# Altium project MSPM0G3507板卡.PrjPcb
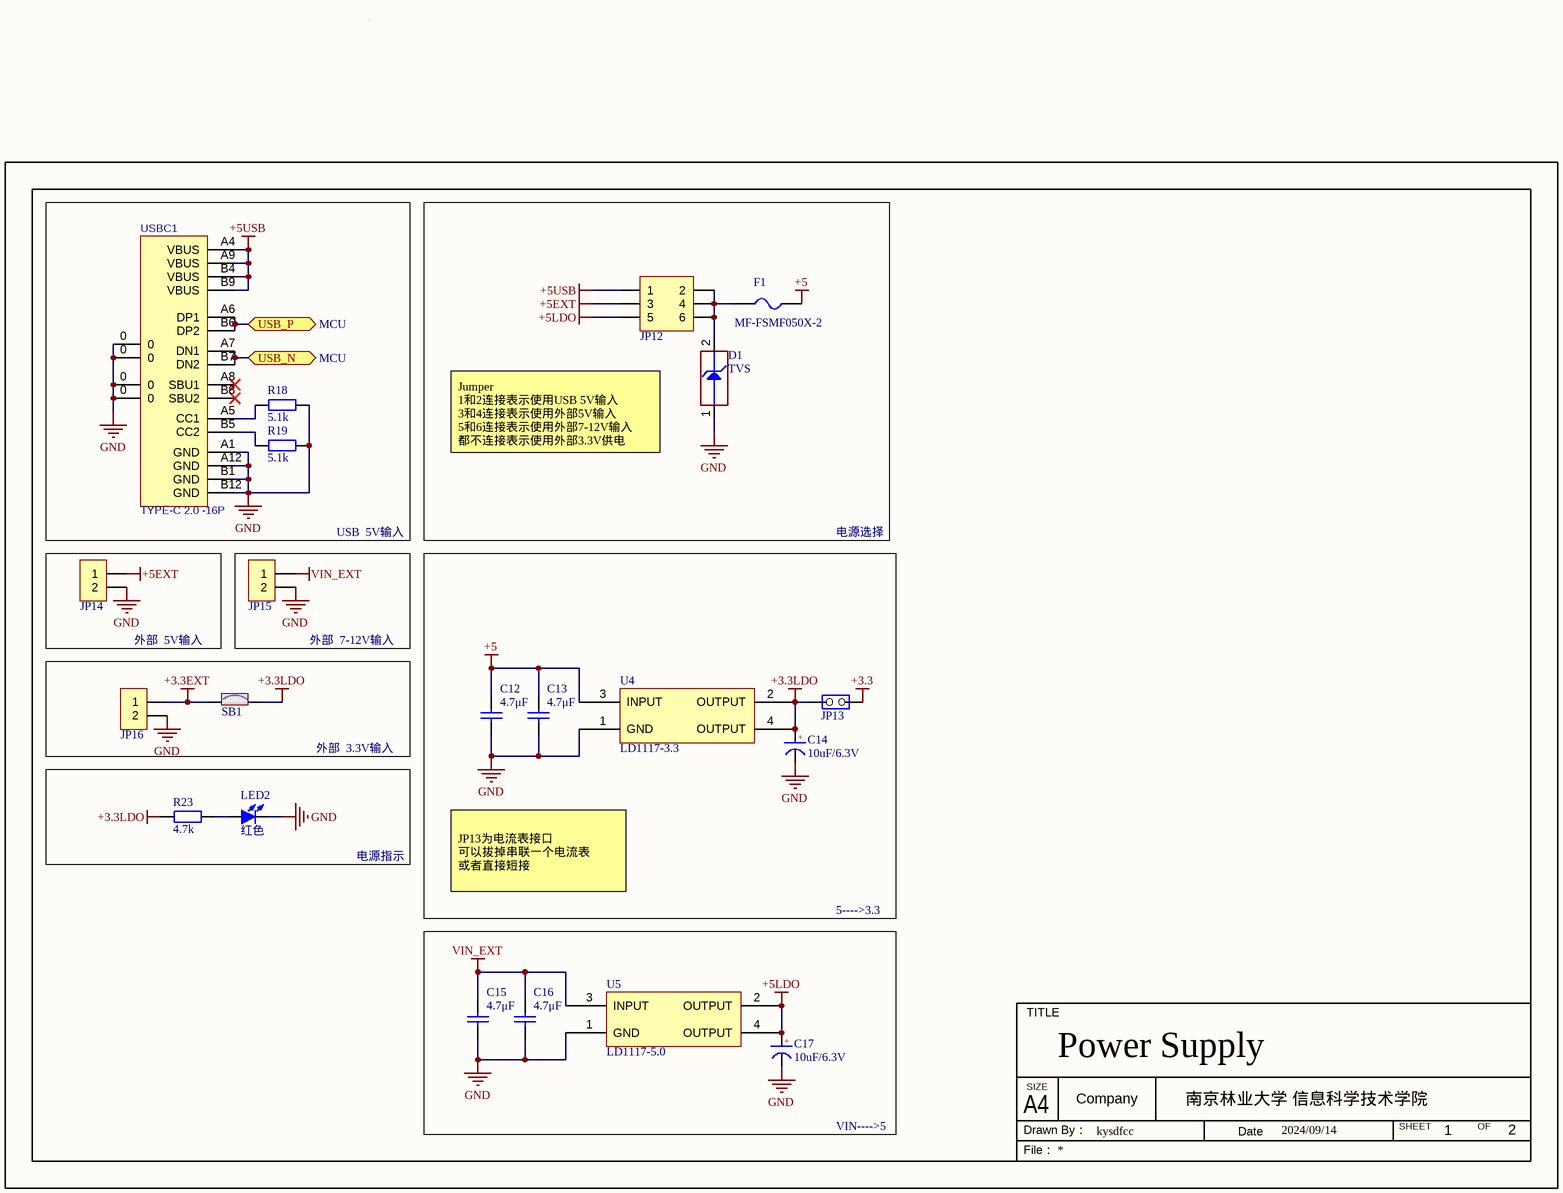
[diagram p0: Power_Supply.SchDoc]
2 sheets, 71 parts. Net scope: flat (ports and power ports of the same name join across sheets).
Board file: Board.PcbDoc
Sheets:
  Power_Supply.SchDoc
  MCU.SchDoc

## Sheet Power_Supply.SchDoc: Power Supply
size A4; Date: 2024/09/14; Author: kysdfcc; CompanyName: 南京林业大学 信息科学技术学院; SheetNumber: 1; SheetTotal: 2

### Parts
C12  4.7μF  [C 0603_L]
C13  4.7μF  [C 0603_L]
C14  10uF/6.3V  [CD A(3216)]
C15  4.7μF  [C 0603_L]
C16  4.7μF  [C 0603_L]
C17  10uF/6.3V  [CD A(3216)]
D1  TVS  [SOD-123]
F1  MF-FSMF050X-2  [FU 0603]
JP12  Header3X2  [HDR2.54-LI-2x3P]  (value not drawn)
JP13  Jumper_Header 2x1  [CON_SAMTEC_TSW-102-07-G-S]  (value not drawn)
JP14  HDR-1X2  [HDR2.54-LI-2P]  (value not drawn)
JP15  HDR-1X2  [HDR2.54-LI-2P]  (value not drawn)
JP16  HDR-1X2  [HDR2.54-LI-2P]  (value not drawn)
LED2  红色  [LED 0603R]
R18  5.1k  [R 0603_L]
R19  5.1k  [R 0603_L]
R23  4.7k  [R 0603_L]
SB1  SB_ON  [SOLDER-BRIDGE_R0603-0R]  (value not drawn)
U4  LD1117-3.3  [LM1117 SOT223]
U5  LD1117-5.0  [LM1117 SOT223]
USBC1  TYPE-C 2.0 -16P  [USB-C-SMD_TYPE-C-USB-5]

### Blocks framed on the sheet
USB  5V输入: R18 R19 USBC1
电源选择: D1 F1 JP12
外部  5V输入: JP14
5---->3.3: C12-C14 JP13 U4

### Ports
USB_N (bidir, see MCU), USB_P (bidir, see MCU)

### Nets
+3.3: JP13.2(NO)
+3.3EXT: JP16.1 SB1.1
+3.3LDO: C14.1(A) JP13.1(COMMON) R23.2 SB1.2 U4.2(OUTPUT) U4.4(OUTPUT)
+5: C12.2 C13.2 F1.2 U4.3(INPUT)
+5EXT: JP12.3 JP14.1
+5LDO: C17.1(A) JP12.5 U5.2(OUTPUT) U5.4(OUTPUT)
+5USB: JP12.1 USBC1.A4(VBUS) USBC1.A9(VBUS) USBC1.B4(VBUS) USBC1.B9(VBUS)
GND: C12.1 C13.1 C14.2(K) C15.1 C16.1 C17.2(K) D1.1(IO1) JP14.2 JP15.2 JP16.2 LED2.2(K) R18.2 R19.2 U4.1(GND) U5.1(GND) USBC1.0 USBC1.A1(GND) USBC1.A12(GND) USBC1.B1(GND) USBC1.B12(GND)
VIN_EXT: C15.2 C16.2 JP15.1 U5.3(INPUT)
NetD1_2: D1.2(GND) F1.1 JP12.2 JP12.4 JP12.6
NetLED2_1: LED2.1(A) R23.1
NetR18_1: R18.1 USBC1.A5(CC1)
NetR19_1: R19.1 USBC1.B5(CC2)
NetU2_1: USBC1.A6(DP1) USBC1.B6(DP2) ; port USB_P
NetU2_2: USBC1.A7(DN1) USBC1.B7(DN2) ; port USB_N

Not connected (* = marked no-connect by the designer): USBC1 A8(SBU1)* B8(SBU2)*

### Notes on the sheet
- Jumper
  1和2连接表示使用USB 5V输入
  3和4连接表示使用外部5V输入
  5和6连接表示使用外部7-12V输入
  都不连接表示使用外部3.3V供电
- 外部  7-12V输入
- 外部  3.3V输入
- 电源指示
- JP13为电流表接口
  可以拔掉串联一个电流表
  或者直接短接
- VIN---->5
- TITLE
- SIZE
- A4
- Drawn By：
- File：
- Company
- Date
- SHEET
- OF
- (in symbol CT) +

### Library data of the parts
C12 C13 C15 C16 = C: 贴片电容; Name: 无极性贴片电容
C14 C17 = CT: 贴片钽电容; Name: 贴片钽电容
D1 = TVS: High power Transient voltage suppressor:25V/35A EOS and ESD transients protection.; Internal_Part_Number: MCD-01207; Part_Type: Diode; Manufacturer_Part_Number: ESDA25P35-1U1M; Manufacturer: STMICROELECTRONICS; BMS_Part_Number: 9179045; ECCN_US: EAR99; ECCN_EU: NEC; Provided_By: SUBCO with ST control; Status: Checked; Package: QFN1610; ComponentLink1Description: Datasheet; ComponentLink1URL: http://tunmcdsvn.tun.st.com/Component_Datasheet_Library/Trunk/Diodes/STM_ESD_ESDA25P35-1U1M; Value: TVS
F1 = FU: 贴片保险丝; Name: 贴片保险丝
JP12 = Header 3X2: 3*2P接插件; Name: 3*2P接插件
JP13 = Header 2x1: Header, 2x1, 2,54mm, VR, TH, Height 5.84mm/2.54mm; Internal_Part_Number: MCD-00045; Part_Preference: Recommended; Part_Type: Connector; Manufacturer: SAMTEC; Manufacturer_Part_Number: TSW-102-07-G-S; Alternate_Manufacturer: JIUBABA; LIANYI; Alternate_Manufacturer_Part_Number: 313102S111116;313102S111116; Status: Released; ComponentLink1Description: Datasheet; ComponentLink1URL: http://tunmcdsvn.tun.st.com/Component_Datasheet_Library/Trunk/Connectors/Samtec_TSW-HTSW-series
JP14-JP16 = Header 2: 2P接插件; Name: 2P接插件
LED2 = LED-SMD: 贴片LED; Name: 贴片LED
R18 R19 R23 = R: 贴片电阻; Name: 贴片电阻
SB1 = Solder Bridge: Solder Bridge ON; Internal_Part_Number: MCD-00071; Part_Type: Mechanical; Manufacturer_Part_Number: RC0603JR-070RL; Manufacturer: YAGEO; Provided_By: SUBCO; Status: Released; ComponentLink1Description: Datasheet; Package: SB0603; ComponentLink1URL: http://tunmcdsvn.tun.st.com/Component_Datasheet_Library/Trunk/Resistors/Yageo_Resistor_RC0603-series; ECCN_US: n/a; ECCN_EU: n/a
U4 U5 = LD1117
USBC1 = USB2.0 Type-C 16Pin母座: USB2.0 Type-C 母座 16Pin

## Sheet MCU.SchDoc: MCU I/O 外设
size 420 x 297 mm; Date: 2024/09/14; Author: kysdfcc; CompanyName: 南京林业大学 信息科学技术学院; SheetNumber: 2; SheetTotal: 2
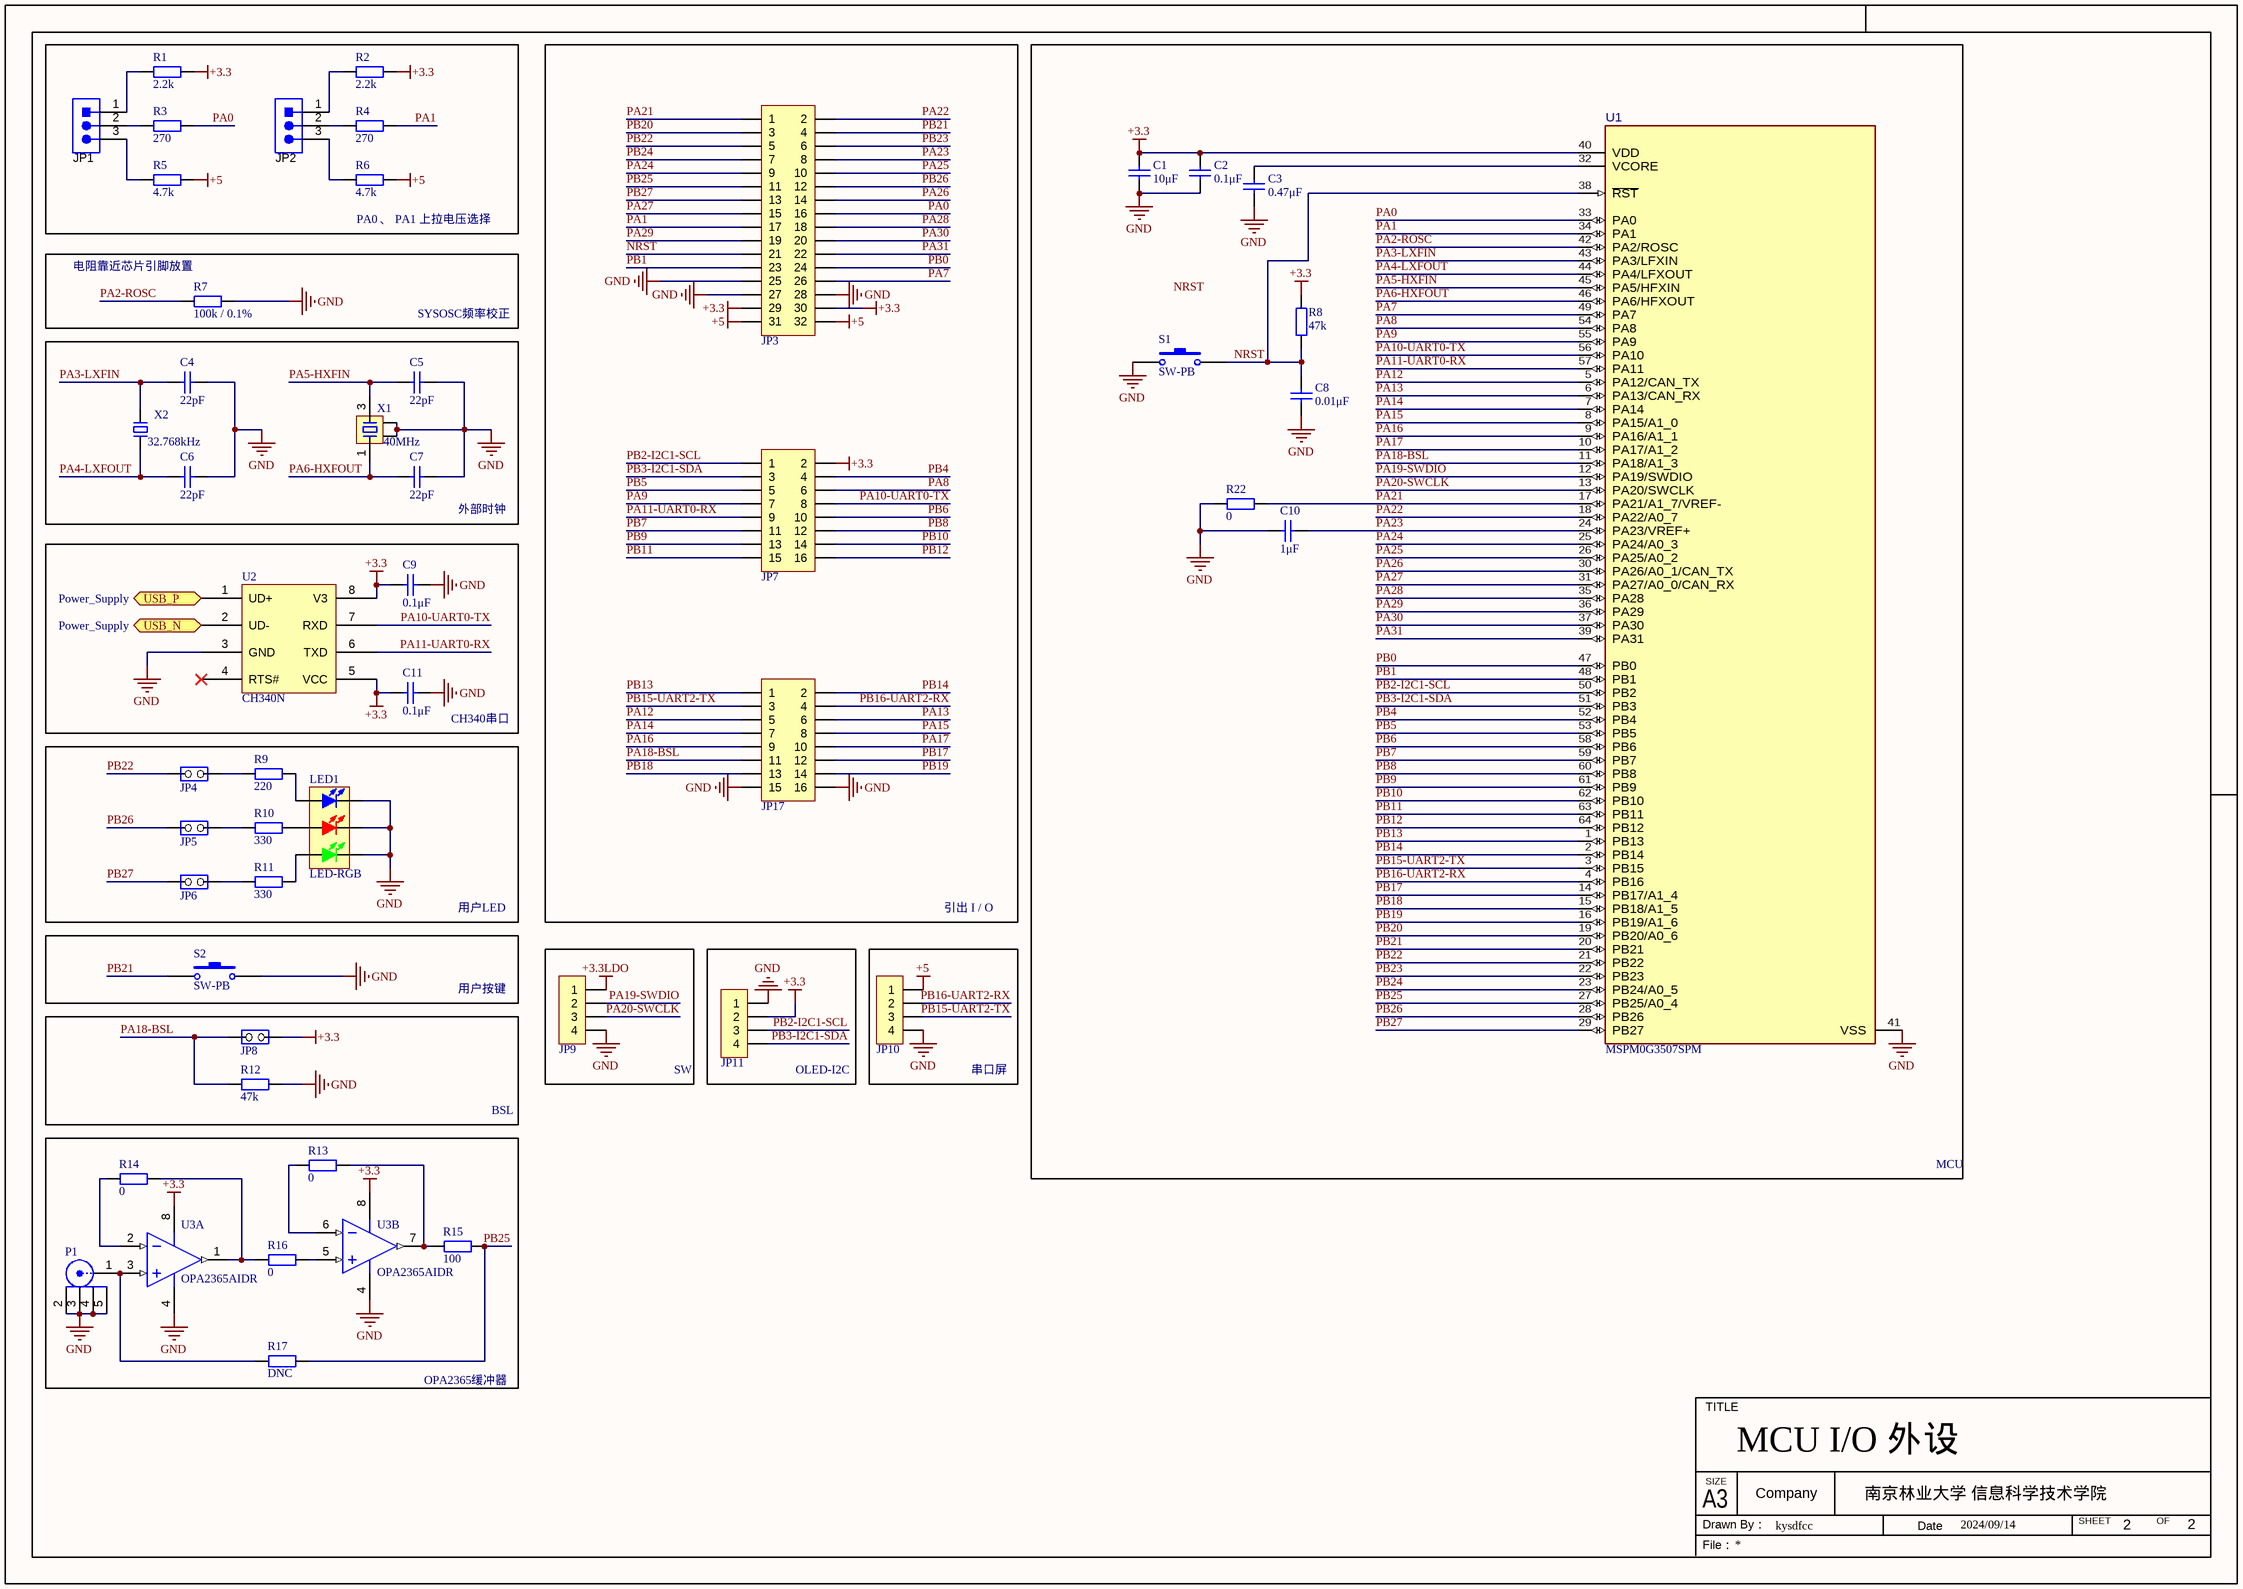
[diagram p1: MCU.SchDoc]

### Parts
C1  10μF  [C 0603_L]
C2  0.1μF  [C 0603_L]
C3  0.47μF  [C 0603_L]
C4  22pF  [C 0603_L]
C5  22pF  [C 0603_L]
C6  22pF  [C 0603_L]
C7  22pF  [C 0603_L]
C8  0.01μF  [C 0603_L]
C9  0.1μF  [C 0603_L]
C10  1μF  [C 0603_L]
C11  0.1μF  [C 0603_L]
JP1  PEC03SAAN  [CONN_PEC03SAAN]  (value not drawn)
JP2  PEC03SAAN  [CONN_PEC03SAAN]  (value not drawn)
JP3  Header 2X11  [HDR2.54-LI-2x16P]  (value not drawn)
JP4  Jumper_Header 2x1  [CON_SAMTEC_TSW-102-07-G-S]  (value not drawn)
JP5  Jumper_Header 2x1  [CON_SAMTEC_TSW-102-07-G-S]  (value not drawn)
JP6  Jumper_Header 2x1  [CON_SAMTEC_TSW-102-07-G-S]  (value not drawn)
JP7  Header 8X2  [HDR2.54-LI-2x8P]  (value not drawn)
JP8  Jumper_Header 2x1  [CON_SAMTEC_TSW-102-07-G-S]  (value not drawn)
JP9  HDR-1X4  [HDR2.54-LI-4P]  (value not drawn)
JP10  HDR-1X4  [HDR2.54-LI-4P]  (value not drawn)
JP11  HDR-1X4  [HDR2.54-M-LI-4P]  (value not drawn)
JP17  Header 8X2  [HDR2.54-LI-2x8P]  (value not drawn)
LED1  LED-RGB  [LED 5050]
P1  (no value)  [TE_5-1814832-1]  (no BOM)
R1  2.2k  [R 0603_L]
R2  2.2k  [R 0603_L]
R3  270  [R 0603_L]
R4  270  [R 0603_L]
R5  4.7k  [R 0603_L]
R6  4.7k  [R 0603_L]
R7  100k / 0.1%  [R 0603_L]
R8  47k  [R 0603_L]
R9  220  [R 0603_L]
R10  330  [R 0603_L]
R11  330  [R 0603_L]
R12  47k  [R 0603_L]
R13  0  [R 0603_L]
R14  0  [R 0603_L]
R15  100  [R 0603_L]
R16  0  [R 0603_L]
R17  DNC  [R 0603_L]
R22  0  [R 0603_L]
S1  SW-PB  [SW_PB2_A1]
S2  SW-PB  [SW_PB2_A1]
U1  MSPM0G3507SPM  [PM0064A-MFG]
U2  CH340N  [SOP8_N]
U3  OPA2365AIDR  [D0008A_L]  (parts A,B of 2)
X1  40MHz  [OSC 3225-4P]
X2  32.768kHz  [OSC 3215-2P]

### Blocks framed on the sheet
PA0 、 PA1 上拉电压选择: JP1 JP2 R1-R6
引出 I / O: JP3 JP7 JP17
MCU: C1-C3 C8 C10 R8 R22 S1 U1
外部时钟: C4-C7 X1 X2
CH340串口: C9 C11 U2
用户LED: JP4-JP6 LED1 R9-R11
用户按键: S2
SW: JP9
OLED-I2C: JP11
串口屏: JP10
BSL: JP8 R12
OPA2365缓冲器: P1 R13-R17 U3

### Ports
USB_N (bidir, see Power_Supply), USB_P (bidir, see Power_Supply)

### Nets
+3.3: C1.2 C2.2 C9.1 C11.2 JP3.29 JP3.30 JP7.2 JP8.2(NO) JP11.2 R1.2 R2.2 R8.2 U1.40(VDD) U2.5(VCC) U2.8(V3) U3.8(V+)
+3.3LDO: JP9.1
+5: JP3.31 JP3.32 JP10.1 R5.1 R6.1
GND: C1.1 C2.1 C3.1 C4.1 C5.1 C6.1 C7.1 C8.1 C9.2 C10.2 C11.1 JP3.25 JP3.27 JP3.28 JP9.4 JP10.4 JP11.1 JP17.15 JP17.16 LED1.1(BULE_K) LED1.3(RED_K) LED1.5(GREEN_K) P1.2 P1.3 P1.4 P1.5 R7.1 R12.1 R22.2 S1.1 S2.2 U1.41(VSS) U2.3(GND) U3.4(V-) X1.2 X1.4
NRST: C8.2 JP3.21 R8.1 S1.2 U1.38(~{RST})
PA0: JP3.16 R3.1 U1.33(PA0)
PA1: JP3.17 R4.1 U1.34(PA1)
PA2-ROSC: R7.2 U1.42(PA2/ROSC)
PA3-LXFIN: C4.2 U1.43(PA3/LFXIN) X2.2
PA4-LXFOUT: C6.2 U1.44(PA4/LFXOUT) X2.1
PA5-HXFIN: C5.2 U1.45(PA5/HFXIN) X1.3
PA6-HXFOUT: C7.2 U1.46(PA6/HFXOUT) X1.1
PA7: JP3.26 U1.49(PA7)
PA8: JP7.6 U1.54(PA8)
PA9: JP7.7 U1.55(PA9)
PA10-UART0-TX: JP7.8 U1.56(PA10) U2.7(RXD)
PA11-UART0-RX: JP7.9 U1.57(PA11) U2.6(TXD)
PA12: JP17.5 U1.5(PA12/CAN_TX)
PA13: JP17.6 U1.6(PA13/CAN_RX)
PA14: JP17.7 U1.7(PA14)
PA15: JP17.8 U1.8(PA15/A1_0)
PA16: JP17.9 U1.9(PA16/A1_1)
PA17: JP17.10 U1.10(PA17/A1_2)
PA18-BSL: JP8.1(COMMON) JP17.11 R12.2 U1.11(PA18/A1_3)
PA19-SWDIO: JP9.2 U1.12(PA19/SWDIO)
PA20-SWCLK: JP9.3 U1.13(PA20/SWCLK)
PA21: JP3.1 R22.1 U1.17(PA21/A1_7/VREF-)
PA22: JP3.2 U1.18(PA22/A0_7)
PA23: C10.1 JP3.8 U1.24(PA23/VREF+)
PA24: JP3.9 U1.25(PA24/A0_3)
PA25: JP3.10 U1.26(PA25/A0_2)
PA26: JP3.14 U1.30(PA26/A0_1/CAN_TX)
PA27: JP3.15 U1.31(PA27/A0_0/CAN_RX)
PA28: JP3.18 U1.35(PA28)
PA29: JP3.19 U1.36(PA29)
PA30: JP3.20 U1.37(PA30)
PA31: JP3.22 U1.39(PA31)
PB0: JP3.24 U1.47(PB0)
PB1: JP3.23 U1.48(PB1)
PB2-I2C1-SCL: JP7.1 JP11.3 U1.50(PB2)
PB3-I2C1-SDA: JP7.3 JP11.4 U1.51(PB3)
PB4: JP7.4 U1.52(PB4)
PB5: JP7.5 U1.53(PB5)
PB6: JP7.10 U1.58(PB6)
PB7: JP7.11 U1.59(PB7)
PB8: JP7.12 U1.60(PB8)
PB9: JP7.13 U1.61(PB9)
PB10: JP7.14 U1.62(PB10)
PB11: JP7.15 U1.63(PB11)
PB12: JP7.16 U1.64(PB12)
PB13: JP17.1 U1.1(PB13)
PB14: JP17.2 U1.2(PB14)
PB15-UART2-TX: JP10.3 JP17.3 U1.3(PB15)
PB16-UART2-RX: JP10.2 JP17.4 U1.4(PB16)
PB17: JP17.12 U1.14(PB17/A1_4)
PB18: JP17.13 U1.15(PB18/A1_5)
PB19: JP17.14 U1.16(PB19/A1_6)
PB20: JP3.3 U1.19(PB20/A0_6)
PB21: JP3.4 S2.1 U1.20(PB21)
PB22: JP3.5 JP4.1(COMMON) U1.21(PB22)
PB23: JP3.6 U1.22(PB23)
PB24: JP3.7 U1.23(PB24/A0_5)
PB25: JP3.11 R15.1 R17.1 U1.27(PB25/A0_4)
PB26: JP3.12 JP5.1(COMMON) U1.28(PB26)
PB27: JP3.13 JP6.1(COMMON) U1.29(PB27)
NetC3_2: C3.2 U1.32(VCORE)
NetJP1_1: JP1.1 R1.1
NetJP1_2: JP1.2 R3.2
NetJP1_3: JP1.3 R5.2
NetJP2_1: JP2.1 R2.1
NetJP2_2: JP2.2 R4.2
NetJP2_3: JP2.3 R6.2
NetJP4_2: JP4.2(NO) R9.2
NetJP5_2: JP5.2(NO) R10.2
NetJP6_2: JP6.2(NO) R11.2
NetLED1_2: LED1.2(BULE_A) R9.1
NetLED1_4: LED1.4(RED_A) R10.1
NetLED1_6: LED1.6(GREEN_A) R11.1
NetP1_1: P1.1 R17.2 U3.3(IN_A+)
NetR13_1: R13.1 R15.2 U3.7(VOUT_B)
NetR13_2: R13.2 U3.6(IN_B-)
NetR14_1: R14.1 R16.2 U3.1(VOUT_A)
NetR14_2: R14.2 U3.2(IN_A-)
NetR16_1: R16.1 U3.5(IN_B+)
NetU2_1: U2.1(UD+) ; port USB_P
NetU2_2: U2.2(UD-) ; port USB_N

Not connected (* = marked no-connect by the designer): U2 4(RTS#)*

### Notes on the sheet
- 电阻靠近芯片引脚放置
- SYSOSC频率校正
- Labels drawn without touching a wire or pin: NRST
- TITLE
- SIZE
- A3
- Drawn By：
- File：
- Company
- Date
- SHEET
- OF

### Library data of the parts
C1-C11 = C: 贴片电容; Name: 无极性贴片电容
JP1 JP2 = Header 3x1: Header, 100mil, 3x1, Tin, TH; Manufacturer: Sullins Connector Solutions; CNHeader: TRUE; Current_A: 3A; Green_Lifecycle: Not Set; Shrouded: N; Gender: Male; Green_REACh: Incomplete; Voltage_V: 1.8kV; Row_Count: 1; Pitch_mm: 2.54; CT: FALSE; Cert_UL: Y; ComponentLink1URL: http://www.sullinscorp.com/catalogs/77_PAGE108-109_.100_MALE_HDR.pdf; ClassName: Header; Publisher: Texas Instruments; Color: Black; RoHS: Y; MountType: TH; Green_EU RoHS-2: Incomplete; Supplier 1: Digi-Key; Green_EU RoHS: Incomplete; PackageReference: Header, 3 PIN, 100mil, Tin; PinCount: 3; CompType: Header; LatestRevisionDate: 26/05/2017; PartNumber: PEC03SAAN; Orientation: Vertical; ComponentLink1Description: Datasheet URL; Supplier Part Number 1: S1012E-03-ND; ContactFinish: Tin
JP3 = Header 16X2: 16*2P接插件; Name: 16*2P接插件
JP4-JP6 JP8 = Header 2x1: as JP13 on sheet Power_Supply; Status: Released; ComponentLink1Description: Datasheet; ComponentLink1URL: http://tunmcdsvn.tun.st.com/Component_Datasheet_Library/Trunk/Connectors/Samtec_TSW-HTSW-series
JP7 JP17 = Header 8X2: 8*2P接插件; Name: 8*2P接插件
JP9-JP11 = Header 4: 4P接插件; Name: 4P接插件
LED1 = LED-RGB 5050: 5050三基色LED; Name: 三基色LED
P1 = SMA: SMA Straight PCB Socket Die Cast, 50 Ohm, TH; Manufacturer: TE Connectivity; PartNumber: 5-1814832-1; CNHeader: FALSE; Green_Lifecycle: Active; Green_REACh: Passed; CT: TRUE; ComponentLink1URL: http://www.te.com/commerce/DocumentDelivery/DDEController?Action=srchrtrv&DocNm=1814832&DocType=Customer+Drawing&DocLang=English; Supplier Part Number 2: 78M7270; Publisher: Texas Instruments; Supplier 2: Newark; Supplier Part Number 3: 571-5-1814832-1; Supplier 3: Mouser; RoHS: Y; MountType: TH; Green_EU RoHS-2: Incomplete; Supplier 1: Digi-Key; Green_EU RoHS: Passed with Exemption; PackageReference: SMA Straight PCB Socket Die Cast, TH; CompType: SMA; LatestRevisionDate: 26/05/2017; ComponentLink1Description: Datasheet URL; Supplier Part Number 1: A97594-ND
R1-R17 R22 = R: 贴片电阻; Name: 贴片电阻
S1 S2 = SW-PB: 微动开关
U1 = MSPM0G3507: Mixed-Signal Microcontrollers With CAN-FD Interface LQFP64; Manufacturer: Texas Instruments; Number Of I2C Channels: 2; Frequency_Fixed: 80MHz; Number Of Cores: 1; Number Of Pwm Channels: 14; Data Bus Width: 32bits; Standoff Height: 0.05mm; SizeZ_mm: 1.6mm; Number Of I/Os: 60; Memory Type: FLASH; Min Supply Voltage: 1.62V; Number Of Adc Channels: 16; Memory Size: 128KBytes; TJmax_C: +130°C; Number Of Uart Channels: 4; Number Of Timers/Counters: 7; Max Supply Voltage: 3.6V; TaMin_C: -40°C; Core Architecture: ARM Cortex-M0+; Interface: I2C,SPI,UART,CAN,LIN,IrDA,SMBus; Ram Size: 32KBytes; AEC Qualified: No; TaMax_C: +125°C; Number Of A/D Converters: 2; helpURL: https://upverter.com/upn/revision/bc7c7c23c86c8513/; Part Number: MSPM0G3507SPM; Number Of Spi Channels: 2; PackageReference: LQFP64; Datasheet Path: datasheets/IC-MSPM0G3507SPM.pdf; RoHS: UNKNOWN; Operating Temperature Range: -40°C to +125°C; PartNumber: MSPM0G3507SPM
U3 = OPA2365AIDR: 50 MHz, Low-Noise Single-Supply Rail-to-Rail Operational Amplifier, 2.2 to 5.5 V, -40 to 125 degC, 8-pin SOIC (D8), Green (RoHS & no Sb/Br); Manufacturer: Texas Instruments; Sub Family: High Speed Amplifier (>=50MHz), Low Input Bias Current Amp (<=10pA), Low Offset Voltage Amplifier (<=500uV), Low Supply Voltage Amplifier (<=2.7V); Total Supply Voltage(Min)(+5V is 5, +/-5V is 10): 2.2; Slew Rate(Typ)(V/us): 25; Vio (25C)(Max)(mV): 0.2; IIB(Max)(pA): 10; Total Supply Voltage(Max)(+5V is 5, +/-5V is 10): 5.5; Offset Drift(Typ)(uV/C): 1; Iq per channel(Max)(mA): 5; CMRR(Min)(dB): 100; Number of Channels: 2; ComponentLink1URL: http://www.ti.com/; Code_JEDEC: MS-012; PackageDescription: 8-Pin Plastic Small Outline, Body 4.9 x 3.9 mm, Pitch 1.27 mm; ComponentLink2URL: http://www.ti.com/general/docs/lit/getliterature.tsp?genericPartNumber=OPA2365&fileType=pdf; ComponentLink3Description: Package Specification; Eco-Plan: Green (RoHS & no Sb/Br); ComponentLink2Description: Datasheet; ComponentLink3URL: http://www.ti.com/litv/pdf/msoi002j; PackageReference: D0008A; DatasheetVersion: SBOS365D; PackageVersion: 4040047-3/M, 06/2011; ComponentLink1Description: Manufacturer URL; Mounting Technology: Surface Mount; PartId: 1; PartNumber: OPA2365AIDR
X1 = XTAL-4P: 4脚无源晶振; Name: 4脚无源晶振
X2 = XTAL-2P: 2脚无源脚晶振; Name: 2脚无源脚晶振

## Nets that join several sheets
+3.3: Power_Supply (JP13.2), MCU (16 pins)
+3.3LDO: Power_Supply (6 pins), MCU (JP9.1)
+5: Power_Supply (C12.2 C13.2 F1.2 U4.3), MCU (5 pins)
GND: Power_Supply (20 pins), MCU (36 pins)
NetU2_1: Power_Supply (USBC1.A6 USBC1.B6), MCU (U2.1)
NetU2_2: Power_Supply (USBC1.A7 USBC1.B7), MCU (U2.2)